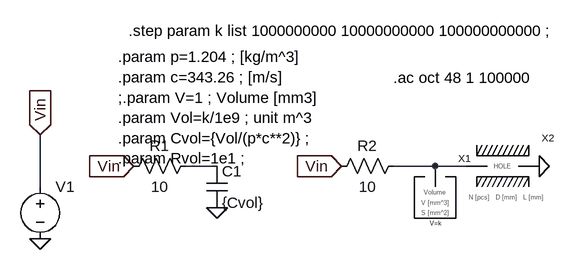
[diagram p0: schematic Volume_test.asc]
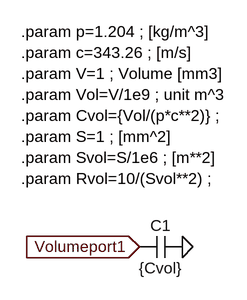
[diagram p1: sub-circuit volumemodel.asc]
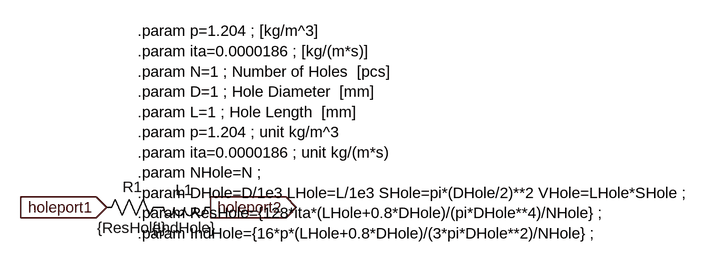
[diagram p2: sub-circuit holemodel.asc]
Volume_test.asc, the LTspice schematic file:
Version 4
SHEET 1 1264 680
WIRE 256 480 208 480
WIRE 592 480 528 480
WIRE 640 480 592 480
WIRE -16 512 -16 432
FLAG -16 592 0
FLAG -16 432 Vin
IOPIN -16 432 In
FLAG 448 480 Vin
IOPIN 448 480 In
FLAG 128 480 Vin
IOPIN 128 480 In
FLAG 256 544 0
FLAG 752 480 0
SYMBOL voltage -16 496 R0
SYMATTR InstName V1
SYMATTR Value ""
SYMATTR Value2 AC 1
SYMBOL My_symbol/Volumemodel 592 480 R0
WINDOW 39 -8 88 Left 0
SYMATTR SpiceLine V=k
SYMATTR InstName X1
SYMBOL cap 240 480 R0
SYMATTR InstName C1
SYMATTR Value {Cvol}
SYMBOL res 224 464 R90
WINDOW 0 0 56 VBottom 2
WINDOW 3 32 56 VTop 2
SYMATTR InstName R1
SYMATTR Value 10
SYMBOL res 544 464 R90
WINDOW 0 0 56 VBottom 2
WINDOW 3 32 56 VTop 2
SYMATTR InstName R2
SYMATTR Value 10
SYMBOL My_symbol/Holemodel 656 448 R0
SYMATTR InstName X2
TEXT 528 344 Left 2 !.ac oct 48 1 100000
TEXT 120 272 Left 2 !.step param k list 1000000000 10000000000 100000000000 ;
TEXT 104 312 Left 2 !.param p=1.204 ; [kg/m^3]\n.param c=343.26 ; [m/s]\n;.param V=1 ; Volume [mm3]\n.param Vol=k/1e9 ; unit m^3\n.param Cvol={Vol/(p*c**2)} ;\n.param Rvol=1e1 ;

volumemodel.asc, the sub-circuit schematic file:
Version 4
SHEET 1 1216 680
FLAG 384 480 Volumeport1
IOPIN 384 480 In
FLAG 448 480 0
SYMBOL cap 448 464 R90
WINDOW 0 0 32 VBottom 2
WINDOW 3 32 32 VTop 2
SYMATTR InstName C1
SYMATTR Value {Cvol}
SYMATTR SpiceLine Rpar={Rvol}
TEXT 208 160 Left 2 !.param p=1.204 ; [kg/m^3]\n.param c=343.26 ; [m/s]\n.param V=1 ; Volume [mm3]\n.param Vol=V/1e9 ; unit m^3\n.param Cvol={Vol/(p*c**2)} ;\n.param S=1 ; [mm^2]\n.param Svol=S/1e6 ; [m**2]\n.param Rvol=10/(Svol**2) ;

holemodel.asc, the sub-circuit schematic file:
Version 4
SHEET 1 1216 680
FLAG 160 432 holeport1
IOPIN 160 432 In
FLAG 320 432 holeport2
IOPIN 320 432 Out
SYMBOL res 256 416 R90
WINDOW 0 0 56 VBottom 2
WINDOW 3 32 56 VTop 2
SYMATTR InstName R1
SYMATTR Value {ResHole}
SYMBOL ind 336 416 R90
WINDOW 0 5 56 VBottom 2
WINDOW 3 32 56 VTop 2
SYMATTR InstName L1
SYMATTR Value {IndHole}
TEXT 208 160 Left 2 !.param p=1.204 ; [kg/m^3]\n.param ita=0.0000186 ; [kg/(m*s)]\n.param N=1 ; Number of Holes  [pcs]\n.param D=1 ; Hole Diameter  [mm]\n.param L=1 ; Hole Length  [mm]\n.param p=1.204 ; unit kg/m^3\n.param ita=0.0000186 ; unit kg/(m*s)\n.param NHole=N ;\n.param DHole=D/1e3 LHole=L/1e3 SHole=pi*(DHole/2)**2 VHole=LHole*SHole ;\n.param ResHole={128*ita*(LHole+0.8*DHole)/(pi*DHole**4)/NHole} ;\n.param IndHole={16*p*(LHole+0.8*DHole)/(3*pi*DHole**2)/NHole} ;

The netlist it stands for:
* Volume_test.asc
V1 Vin 0 AC 1
XX1 N002 volumemodel params: V=k
C1 N001 0 {Cvol}
R1 N001 Vin 10
R2 N002 Vin 10
XX2 N002 0 holemodel

* block symbol definitions
.subckt volumemodel Volumeport1
C1 0 Volumeport1 {Cvol} Rpar={Rvol}
.param p=1.204 ; [kg/m^3]
.param c=343.26 ; [m/s]
.param V=1 ; Volume [mm3]
.param Vol=V/1e9 ; unit m^3
.param Cvol={Vol/(p*c**2)} ;
.param S=1 ; [mm^2]
.param Svol=S/1e6 ; [m**2]
.param Rvol=10/(Svol**2) ;
.ends volumemodel

.subckt holemodel holeport1 holeport2
R1 P001 holeport1 {ResHole}
L1 holeport2 P001 {IndHole}
.param p=1.204 ; [kg/m^3]
.param ita=0.0000186 ; [kg/(m*s)]
.param N=1 ; Number of Holes  [pcs]
.param D=1 ; Hole Diameter  [mm]
.param L=1 ; Hole Length  [mm]
.param p=1.204 ; unit kg/m^3
.param ita=0.0000186 ; unit kg/(m*s)
.param NHole=N ;
.param DHole=D/1e3 LHole=L/1e3 SHole=pi*(DHole/2)**2 VHole=LHole*SHole ;
.param ResHole={128*ita*(LHole+0.8*DHole)/(pi*DHole**4)/NHole} ;
.param IndHole={16*p*(LHole+0.8*DHole)/(3*pi*DHole**2)/NHole} ;
.ends holemodel

.ac oct 48 1 100000
.step param k list 1000000000 10000000000 100000000000 ;
.param p=1.204 ; [kg/m^3]
.param c=343.26 ; [m/s]
;.param V=1 ; Volume [mm3]
.param Vol=k/1e9 ; unit m^3
.param Cvol={Vol/(p*c**2)} ;
.param Rvol=1e1 ;
.backanno
.end